# EAGLE design rev_b (EAGLE 7.6.0)
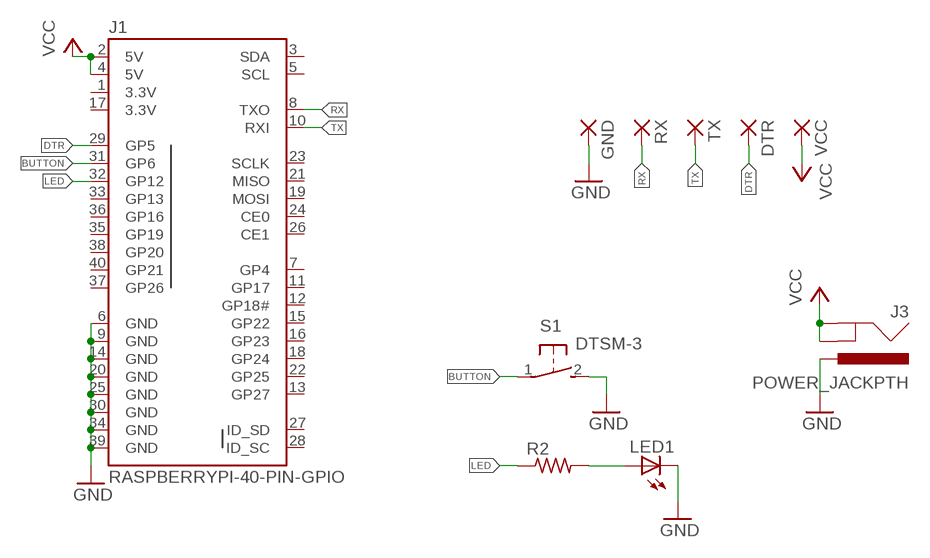
[diagram p0: schematic, sheet 1]

## Parts
DTR  SMD5  [SMD2,54-5,08]
GND  SMD5  [SMD2,54-5,08]
J1  RASPBERRYPI-40-PIN-GPIO  [2X20-SHROUDED]
J3  POWER_JACKPTH  [POWER_JACK_PTH]
LED1  LEDSML0805  [SML0805]
R2  R-US_R0805  [R0805]
RX  SMD5  [SMD2,54-5,08]
S1  DTSM-3  [DTSM-3]
TX  SMD5  [SMD2,54-5,08]
VCC  SMD5  [SMD2,54-5,08]

## Nets
BUTTON: J1.31(GP6) S1.1
DTR: DTR.1(P) J1.29(GP5)
GND: GND.1(P) J1.6(GND) J1.9(GND) J1.14(GND) J1.20(GND) J1.25(GND) J1.30(GND) J1.34(GND) J1.39(GND) J3.PWR LED1.C S1.2
LED: J1.32(GP12) R2.1
N$3: LED1.A R2.2
RX: J1.8(TXO) RX.1(P)
TX: J1.10(RXI) TX.1(P)
VCC: J1.2(5V) J1.4(5V) J3.GND J3.GNDBREAK VCC.1(P)
Unconnected: J1.3(SDA) J1.5(SCL) J1.7(GP4) J1.11(GP17) J1.12(GP18#) J1.13(GP27) J1.15(GP22) J1.16(GP23) J1.18(GP24) J1.19(MOSI) J1.21(MISO) J1.22(GP25) J1.23(SCLK) J1.24(CE0) J1.26(CE1) J1.27(ID_SD) J1.28(ID_SC) J1.33(GP13) J1.35(GP19) J1.36(GP16) J1.37(GP26) J1.38(GP20) J1.40(GP21)

## Power pins joined to a net without a drawn wire
3.3V: J1.1(3.3V) J1.17(3.3V)

## Library data of the parts
DTR GND RX TX VCC = wirepad:SMD5: SMD PAD
J1 = SparkFun-Boards:RASPBERRYPI-40-PIN-GPIO: Second Generation Raspberry Pi GPIO Header 2x20 pin connector, as found on B, B+, A+ models.
J3 = SparkFun-Connectors:POWER_JACK: Power Jack This is the standard 5.5mm barrel jack for power. The PTH is the most common, proven, reliable, footprint. The Slot footprint only works if the mill layer is transmitted to the PCB fab house so be warned. Mating wall wart : TOL-00298 (and others); PROD_ID: CONN-08197
LED1 = led:LED: LED OSRAM: - CHIPLED LG R971, LG N971, LY N971, LG Q971, LY Q971, LO R971, LY R971 LH N974, LH R974 LS Q976, LO Q976, LY Q976 LO Q996 - Hyper CHIPLED LW Q18S LB Q993, LB Q99A, LB R99A - SideLED LS A670, LO A670, LY A670, LG A670, LP A670 LB A673, LV A673, LT A673, LW A673 LH A674 LY A675 LS A676, LA A676, LO A676, LY A676, LW A676 LS A679, LY A679, LG A679 - Hyper Micro SIDELED® LS Y876, LA Y876, LO Y876, LY Y876 LT Y87S - SmartLED LW L88C, LW L88S LB L89C, LB L89S, LG L890 LS L89K, LO L89K, LY L89K LS L896, LA L896, LO L896, LY L896 - TOPLED LS T670, LO T670, LY T670, LG T670, LP T670 LSG T670, LSP T670, LSY T670, LOP T670, LYG T670 LG T671, LOG T671, LSG T671 LB T673, LV T673, LT T673, LW T673 LH T674 LS T676, LA T676, LO T676, LY T676, LB T676, LH T676, LSB T676, LW T676 LB T67C, LV T67C, LT T67C, LS T67K, LO T67K, LY T67K, LW E67C LS E67B, LA E67B, LO E67B, LY E67B, LB E67C, LV E67C, LT E67C LW T67C LS T679, LY T679, LG T679 LS T770, LO T770, LY T770, LG T770, LP T770 LB T773, LV T773, LT T773, LW T773 LH T774 LS E675, LA E675, LY E675, LS T675 LS T776, LA T776, LO T776, LY T776, LB T776 LHGB T686 LT T68C, LB T68C - Hyper Mini TOPLED® LB M676 - Mini TOPLED Santana® LG M470 LS M47K, LO M47K, LY M47K Source: http://www.osram.convergy.de LUXEON: - LUMILED® LXK2-PW12-R00, LXK2-PW12-S00, LXK2-PW14-U00, LXK2-PW14-V00 LXK2-PM12-R00, LXK2-PM12-S00, LXK2-PM14-U00 LXK2-PE12-Q00, LXK2-PE12-R00, LXK2-PE12-S00, LXK2-PE14-T00, LXK2-PE14-U00 LXK2-PB12-K00, LXK2-PB12-L00, LXK2-PB12-M00, LXK2-PB14-N00, LXK2-PB14-P00, LXK2-PB14-Q00 LXK2-PR12-L00, LXK2-PR12-M00, LXK2-PR14-Q00, LXK2-PR14-R00 LXK2-PD12-Q00, LXK2-PD12-R00, LXK2-PD12-S00 LXK2-PH12-R00, LXK2-PH12-S00 LXK2-PL12-P00, LXK2-PL12-Q00, LXK2-PL12-R00 Source: www.luxeon.com KINGBRIGHT: KA-3528ASYC Source: www.kingbright.com
R2 = rcl:R-US_: RESISTOR, American symbol
S1 = switch-tact:DTSM-3

## Board
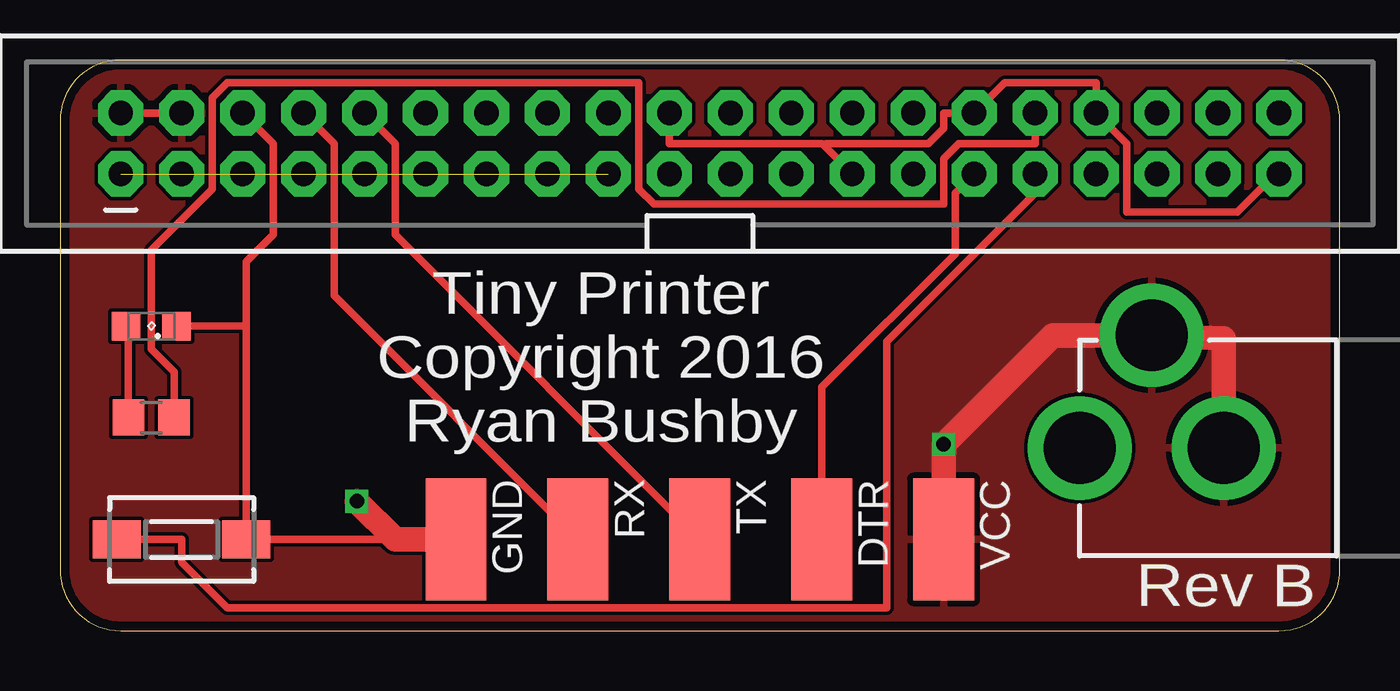
[diagram p1: board, top side]
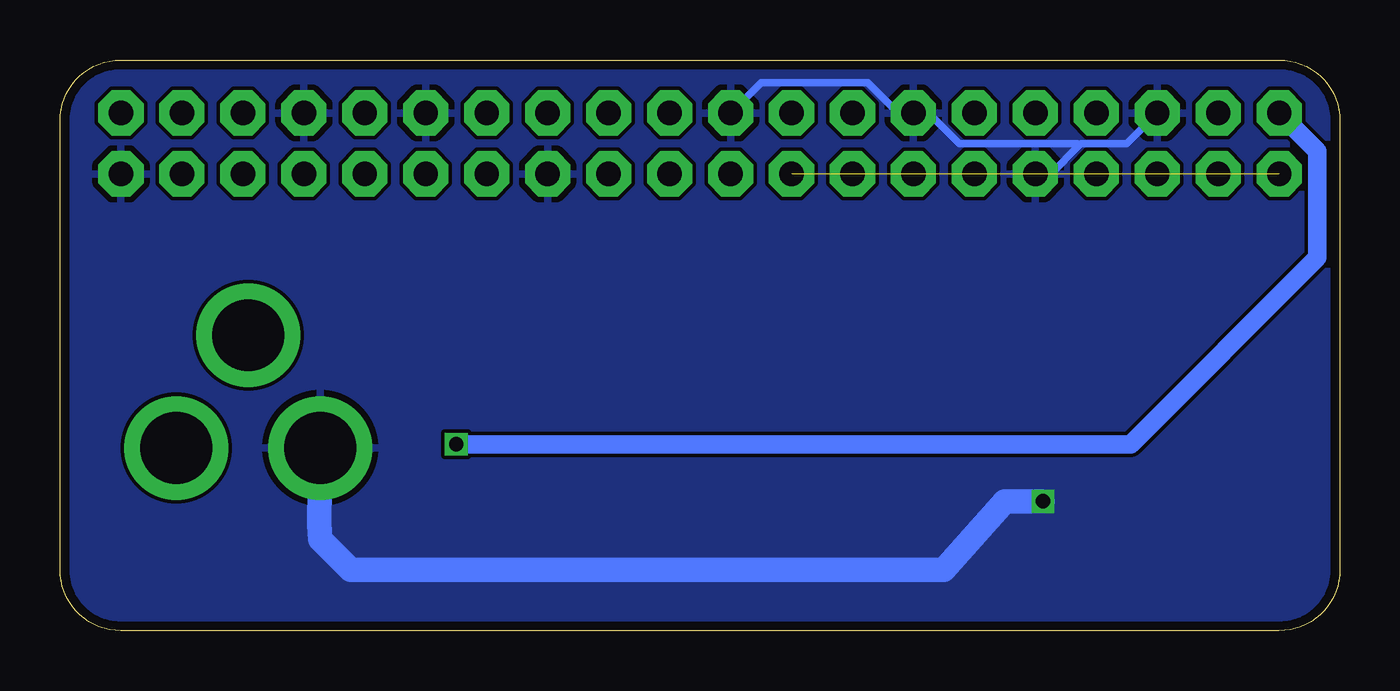
[diagram p2: board, bottom side, seen from below]

Size 53.33 x 23.8 mm. Coordinates in mm from the lower left corner, seen from the top.
Outline: 2.54,0 50.79,0 arc90 53.33,2.54 53.33,21.26 arc90 50.79,23.8 2.54,23.8 arc90 0,21.26 0,2.54 arc90 2.54,0
Copper layers (1*16): Top 0.0356mm / dielectric 1.5011mm / Bottom 0.0356mm
Design rules "LaenPCBOrder *": minimum track width 12mil, minimum drill 13mil, track to track 6mil, track to pad 6mil, pad to pad 6mil, via to via 6mil, smd to smd 6mil, copper to edge 15mil, drill to drill 6mil, minimum pad ring 7mil, minimum via ring 7mil, stop-mask expansion 3mil, vias tented up to drill 100mil, thermal gap 10mil

### Footprints (pad centres in the part's own frame; a part is rotated, then mirrored left to right if it is on the bottom)
SMD2,54-5,08 = smd 2.54 x 5.08: 1 0,0
2X20-SHROUDED = drill 1.016 pad 1.88 octagon: 1 -1.27,24.13; 2 1.27,24.13; 3 -1.27,21.59; 4 1.27,21.59; 5 -1.27,19.05; 6 1.27,19.05; 7 -1.27,16.51; 8 1.27,16.51; 9 -1.27,13.97; 10 1.27,13.97; 11 -1.27,11.43; 12 1.27,11.43; 13 -1.27,8.89; 14 1.27,8.89; 15 -1.27,6.35; 16 1.27,6.35; 17 -1.27,3.81; 18 1.27,3.81; 19 -1.27,1.27; 20 1.27,1.27; 21 -1.27,-1.27; 22 1.27,-1.27; 23 -1.27,-3.81; 24 1.27,-3.81; 25 -1.27,-6.35; 26 1.27,-6.35; 27 -1.27,-8.89; 28 1.27,-8.89; 29 -1.27,-11.43; 30 1.27,-11.43; 31 -1.27,-13.97; 32 1.27,-13.97; 33 -1.27,-16.51; 34 1.27,-16.51; 35 -1.27,-19.05; 36 1.27,-19.05; 37 -1.27,-21.59; 38 1.27,-21.59; 39 -1.27,-24.13; 40 1.27,-24.13
POWER_JACK_PTH = drill 2.997 pad 4.318: GND 0,7.7; GNDBREAK 4.7,10.7; PWR 0,13.7
SML0805 = smd 1.2 x 1.2: A 1.05,0; C -1.05,0
R0805 = smd 1.3 x 1.5: 1 -0.95,0; 2 0.95,0
DTSM-3 = smd 2 x 1.6: 1 -2.7,0; 2 2.7,0

### Placement (x,y rotation side)
DTR  31.74,3.81 180 top
GND  16.5,3.81 180 top
J1  26.66,20.32 90 top
J3  56.19,7.62 90 top
LED1  3.8,12.7 180 top
R2  3.8,8.89 180 top
RX  21.58,3.81 180 top
S1  5.07,3.81 0 top
TX  26.66,3.81 180 top
VCC  36.82,3.81 180 top

### Tracks (layer width: path | path; a pad name or v marks a point on that pad's centre or on a via)
3.3V  (1 unrouted)
BUTTON
  Top 0.305: S1.1 5.07,3.81 5.07,2.86 6.98,0.95 34.44,0.95 34.44,12.06 40.63,18.26 J1.31
DTR
  Top 0.305: J1.29 37.3,18.26 37.3,15.72 31.74,10.16 DTR.1
GND  (via drill 0.6)
  Top 0.305: 7.77,12.7 S1.2 GND.1 | 7.77,12.7 7.77,15.4 8.88,16.51 8.88,20.32 J1.6 | 31.82,20.24 31.74,20.32 25.39,20.32 J1.20 | 31.82,20.24 J1.25 | 31.82,20.24 31.9,20.32 36.19,20.32 36.82,20.95 36.82,21.59 J1.30 39.36,22.86 43.17,22.86 J1.34 44.44,20.32 44.44,17.46 49.04,17.46 50.63,19.05 J1.39 | LED1.C 7.77,12.7
  Top 1.016: v12.37,5.4 13.96,3.81 GND.1
  Bottom 0.305: J1.9 12.05,19.05 10.86,20.24 | 10.86,20.24 10.79,20.32 8.88,20.32 J1.6 | 10.86,20.24 10.94,20.32 15.87,20.32 17.13,21.59 J1.14 18.4,21.59 19.67,22.86 24.12,22.86 J1.20
  Bottom 1.016: J3.PWR 42.54,4.45 42.49,3.81 41.22,2.54 16.5,2.54 13.96,5.4 v12.37,5.4
  pour Bottom: 2.53,23.81 50.79,23.81 arc-90 53.33,21.27 53.33,2.54 arc-90 50.79,0 2.53,0 arc-90 -0.01,2.54 -0.01,21.27 arc-90
LED
  Top 0.305: J1.32 40.63,20.32 37.46,20.32 36.82,19.68 36.82,17.78 24.75,17.78 24.12,18.41 24.12,22.86 6.98,22.86 6.34,22.23 6.34,18.41 3.8,15.88 3.8,11.75 4.75,10.79 4.75,9.05 4.59,8.89 R2.1
N$3
  Top 0.305: LED1.A 2.85,12.7 R2.2
RX
  Top 0.305: J1.8 11.42,20.32 11.42,13.97 RX.1
TX
  Top 0.305: J1.10 13.96,20.32 13.96,16.51 TX.1
VCC  (via drill 0.6)
  Top 0.305: J1.4 J1.2
  Top 1.016: J3.GND 48.49,12.18 J3.GNDBREAK 41.36,12.32 v36.82,7.78 VCC.1
  Bottom 0.762: v36.82,7.78 8.72,7.78 0.94,15.56 0.94,20 J1.2
  pour Top: 2.53,23.81 50.79,23.81 arc-90 53.33,21.27 53.33,2.54 arc-90 50.79,0 2.53,0 arc-90 -0.01,2.54 -0.01,21.27 arc-90

### Text on the board
tNames: Tiny Printer / Copyright 2016 / Ryan Bushby | Rev B